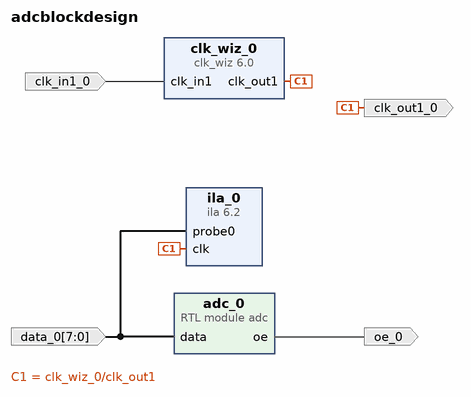
[diagram p0: block diagram of the top level]
# Vivado block design adcblockdesign, xc7s15ftgb196-1, Vivado 2018.2
create_bd_design adcblockdesign

create_bd_port -dir I -from 7 -to 0 data_0
create_bd_port -dir O oe_0
create_bd_port -dir I -type clk clk_in1_0
create_bd_port -dir O -type clk clk_out1_0
set_property -dict {CONFIG.FREQ_HZ 12000000} [get_bd_ports clk_out1_0]

create_bd_cell -type module -reference adc adc_0
create_bd_cell -type ip -vlnv xilinx.com:ip:clk_wiz:6.0 clk_wiz_0
set_property -dict [list \
  CONFIG.CLKOUT1_REQUESTED_OUT_FREQ 12.000 \
  CONFIG.USE_LOCKED false \
  CONFIG.USE_RESET false \
  CONFIG.MMCM_DIVCLK_DIVIDE 5 \
  CONFIG.MMCM_CLKFBOUT_MULT_F 49.875 \
  CONFIG.MMCM_CLKOUT0_DIVIDE_F 83.125 \
  CONFIG.CLKOUT1_JITTER 345.775 \
  CONFIG.CLKOUT1_PHASE_ERROR 293.793 \
] [get_bd_cells clk_wiz_0]
create_bd_cell -type ip -vlnv xilinx.com:ip:ila:6.2 ila_0
set_property -dict [list \
  CONFIG.C_PROBE0_WIDTH 8 \
  CONFIG.C_DATA_DEPTH 32768 \
  CONFIG.C_NUM_OF_PROBES 1 \
  CONFIG.C_ENABLE_ILA_AXI_MON false \
  CONFIG.C_MONITOR_TYPE Native \
] [get_bd_cells ila_0]

# ---- connections ----

connect_bd_net -net data_0_1 [get_bd_ports data_0] [get_bd_pins adc_0/data] [get_bd_pins ila_0/probe0]
connect_bd_net [get_bd_pins adc_0/oe] [get_bd_ports oe_0]
connect_bd_net -net clk_in1_0_1 [get_bd_ports clk_in1_0] [get_bd_pins clk_wiz_0/clk_in1]
connect_bd_net [get_bd_pins clk_wiz_0/clk_out1] [get_bd_ports clk_out1_0] [get_bd_pins ila_0/clk]

validate_bd_design
save_bd_design
